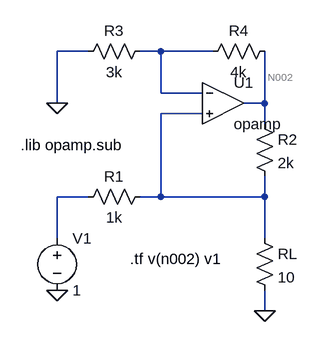
[diagram p0: schematic pag7es14p1.asc]
pag7es14p1.asc, the LTspice schematic file:
Version 4
SHEET 1 880 680
WIRE 96 48 48 48
WIRE 208 48 176 48
WIRE 288 48 208 48
WIRE 208 112 208 48
WIRE 272 112 208 112
WIRE 48 128 48 48
WIRE 368 128 368 48
WIRE 368 128 336 128
WIRE 272 144 208 144
WIRE 368 160 368 128
WIRE 96 272 48 272
WIRE 208 272 208 144
WIRE 208 272 176 272
WIRE 368 272 368 240
WIRE 368 272 208 272
WIRE 48 336 48 272
WIRE 368 336 368 272
WIRE 368 448 368 416
FLAG 48 128 0
FLAG 48 416 0
FLAG 368 448 0
SYMBOL res 192 32 R90
WINDOW 0 0 56 VBottom 2
WINDOW 3 32 56 VTop 2
SYMATTR InstName R3
SYMATTR Value 3k
SYMBOL OpAmps\\opamp 304 64 R0
SYMATTR InstName U1
SYMBOL res 384 32 R90
WINDOW 0 0 56 VBottom 2
WINDOW 3 32 56 VTop 2
SYMATTR InstName R4
SYMATTR Value 4k
SYMBOL res 352 144 R0
SYMATTR InstName R2
SYMATTR Value 2k
SYMBOL res 192 256 R90
WINDOW 0 0 56 VBottom 2
WINDOW 3 32 56 VTop 2
SYMATTR InstName R1
SYMATTR Value 1k
SYMBOL voltage 48 320 R0
SYMATTR InstName V1
SYMATTR Value 1
SYMBOL res 352 320 R0
SYMATTR InstName RL
SYMATTR Value 10
TEXT -8 192 Left 2 !.lib opamp.sub
TEXT 160 368 Left 2 !.tf v(n002) v1

The netlist it stands for:
* pag7es14p1.asc
R3 N001 0 3k
XU1 N001 N003 N002 opamp Aol=100K GBW=10Meg  ; pins invin noninvin out
R4 N002 N001 4k
R2 N002 N003 2k
R1 N003 N004 1k
V1 N004 0 1
RL N003 0 10
.lib opamp.sub
.tf v(n002) v1
.backanno
.end